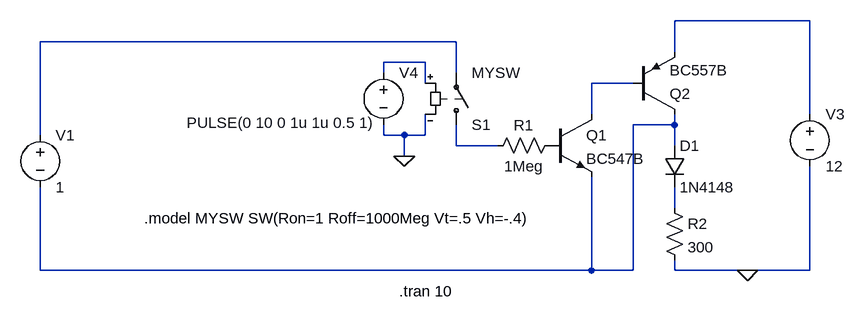
[diagram p0: schematic LTSpice.asc]
LTSpice.asc, the LTspice schematic file:
Version 4
SHEET 1 1064 680
WIRE 1008 32 800 32
WIRE 464 64 -176 64
WIRE 800 80 800 32
WIRE 416 96 352 96
WIRE 352 112 352 96
WIRE 464 112 464 64
WIRE 416 128 416 96
WIRE 736 128 672 128
WIRE 672 176 672 128
WIRE 1008 176 1008 32
WIRE 800 192 800 176
WIRE 800 192 736 192
WIRE -176 208 -176 64
WIRE 352 208 352 192
WIRE 384 208 352 208
WIRE 416 208 416 176
WIRE 416 208 384 208
WIRE 464 224 464 192
WIRE 528 224 464 224
WIRE 800 224 800 192
WIRE 384 240 384 208
WIRE 800 320 800 288
WIRE -176 416 -176 288
WIRE 672 416 672 272
WIRE 672 416 -176 416
WIRE 736 416 736 192
WIRE 736 416 672 416
WIRE 800 416 800 400
WIRE 912 416 800 416
WIRE 1008 416 1008 256
WIRE 1008 416 912 416
FLAG 384 240 0
FLAG 912 416 0
SYMBOL npn 608 176 R0
SYMATTR InstName Q1
SYMATTR Value BC547B
SYMBOL pnp 736 176 M180
SYMATTR InstName Q2
SYMATTR Value BC557B
SYMBOL res 624 208 R90
WINDOW 0 0 56 VBottom 2
WINDOW 3 32 56 VTop 2
SYMATTR InstName R1
SYMATTR Value 1Meg
SYMBOL res 784 304 R0
SYMATTR InstName R2
SYMATTR Value 300
SYMBOL voltage 1008 160 R0
WINDOW 123 0 0 Left 2
WINDOW 39 0 0 Left 2
SYMATTR InstName V3
SYMATTR Value 12
SYMBOL voltage 352 96 R0
WINDOW 3 -303 93 Left 2
WINDOW 123 0 0 Left 2
WINDOW 39 0 0 Left 2
SYMATTR Value PULSE(0 10 0 1u 1u 0.5 1)
SYMATTR InstName V4
SYMBOL sw 464 208 M180
SYMATTR InstName S1
SYMATTR Value MYSW
SYMBOL voltage -176 192 R0
WINDOW 123 0 0 Left 2
WINDOW 39 0 0 Left 2
SYMATTR InstName V1
SYMATTR Value 1
SYMBOL diode 784 224 R0
SYMATTR InstName D1
SYMATTR Value 1N4148
TEXT 376 448 Left 2 !.tran 10
TEXT -16 336 Left 2 !.model MYSW SW(Ron=1 Roff=1000Meg Vt=.5 Vh=-.4)

The netlist it stands for:
* LTSpice.asc
Q1 N004 P001 N005 0 BC547B
Q2 N005 N004 N001 0 BC557B
R1 P001 N006 1Meg
R2 N007 0 300
V3 N001 0 12
V4 N003 0 PULSE(0 10 0 1u 1u 0.5 1)
S1 N006 N002 N003 0 MYSW
V1 N002 N005 1
D1 N005 N007 1N4148
.model D D
.lib standard.dio
.model NPN NPN
.model PNP PNP
.lib standard.bjt
.tran 10
.model MYSW SW(Ron=1 Roff=1000Meg Vt=.5 Vh=-.4)
.backanno
.end